# Altium schematic sheet p1_apfc_and_standby.SchDoc
size A2; Organization: Protel International P/L; Address1: L3, 12a Rodborough Rd; Address2: Frenchs Forest; Address3: NSW; Address4: Australia 2086
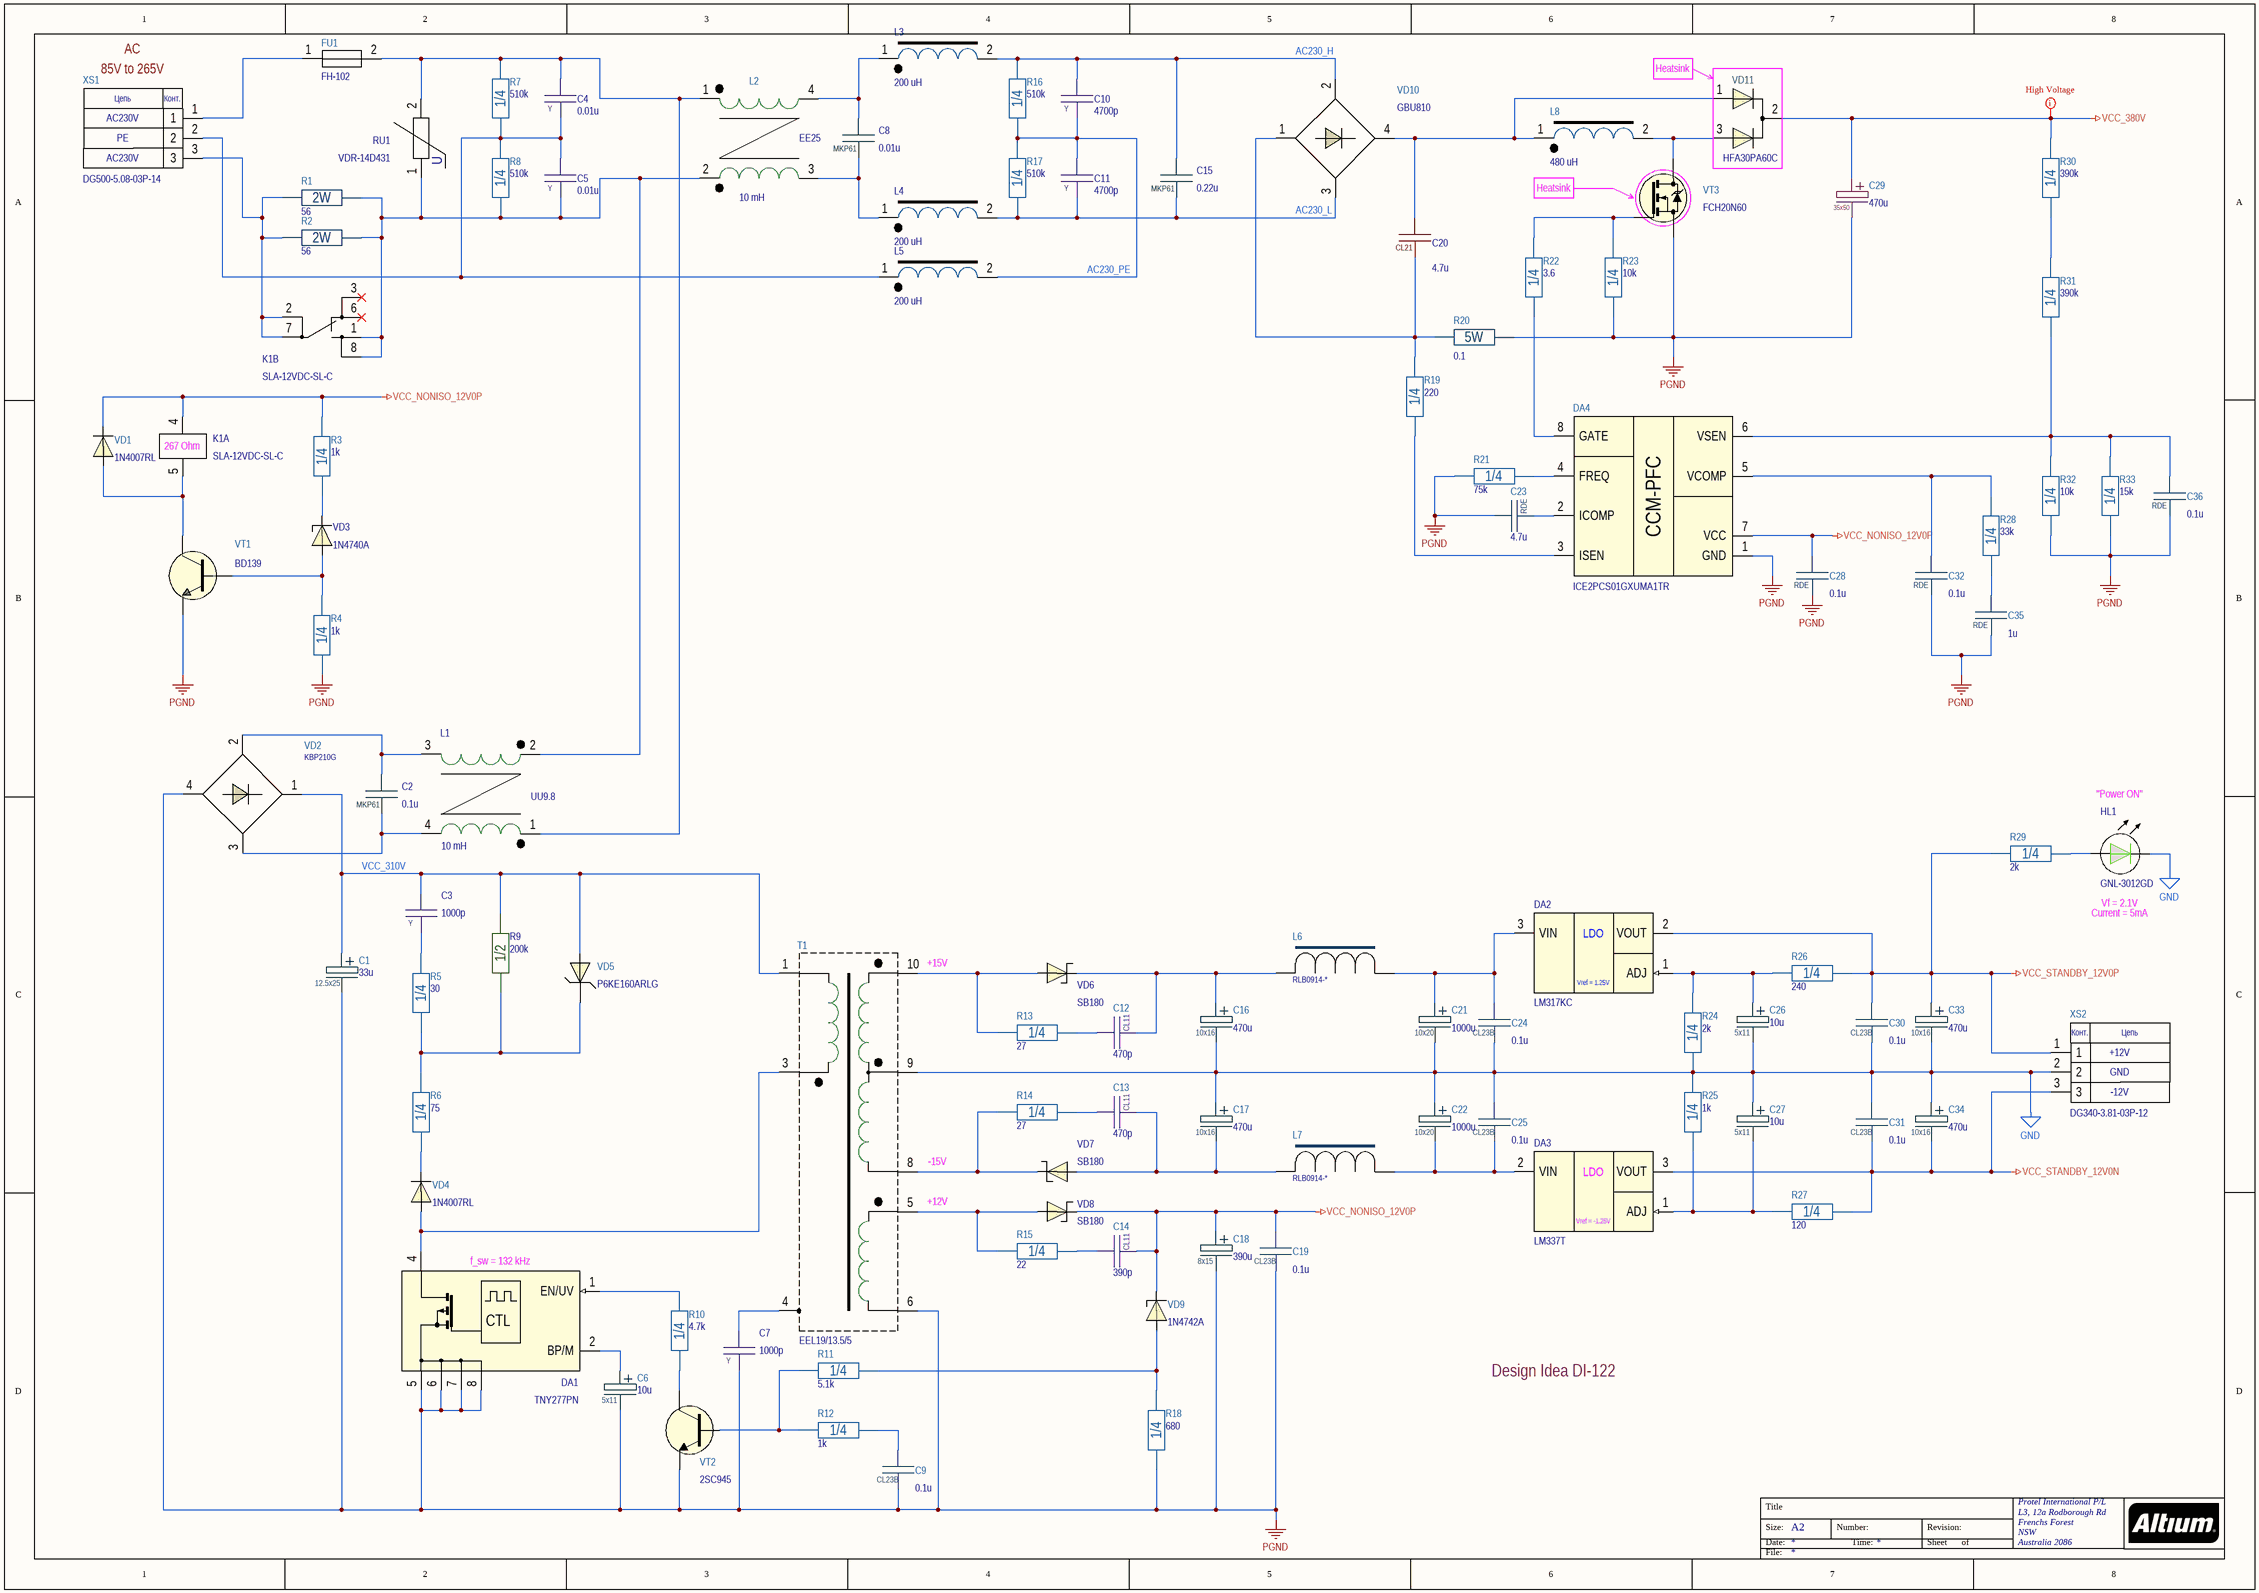
[diagram p0: p1_apfc_and_standby.SchDoc]

## Parts
C1  33u  Package: 12.5x25  [ECAP13X21X5_BRW]
C2  0.1u  [MKP61_13x12x6_P10]
C3  1000p  Package: Y  [JYC_Y2_CAP_7.5]
C4  0.01u  Package: Y  [JYC_Y2_CAP_6.5]
C5  0.01u  Package: Y  [JYC_Y2_CAP_6.5]
C6  10u  Package: 5x11  [ECAP5X11X2.0_BRW]
C7  1000p  Package: Y  [JYC_Y2_CAP_7.5]
C8  0.01u  [MKP61_18x12x6_P15]
C9  0.1u  [CL23B_7.2x2.5]
C10  4700p  Package: Y  [JYC_Y2_CAP_6.5]
C11  4700p  Package: Y  [JYC_Y2_CAP_6.5]
C12  470p  [CL11_6x4_P4.0]
C13  470p  [CL11_6x4_P4.0]
C14  390p  [CL11_6x4_P4.0]
C15  0.22u  [MKP61_18x14.5x8.5_P15]
C16  470u  Package: 10x16  [ECAP10X17X5_BRW]
C17  470u  Package: 10x16  [ECAP10X17X5_BRW]
C18  390u  Package: 8x15  [ECAP8X13.5X3.5_BRW]
C19  0.1u  [CL23B_7.2x2.5]
C20  4.7u  [CL21_29x24.5x14.0_P27.5]
C21  1000u  Package: 10x20  [ECAP10X21X5_BRW]
C22  1000u  Package: 10x20  [ECAP10X21X5_BRW]
C23  4.7u  Package: RDE  [RDE_2P1]
C24  0.1u  [CL23B_7.2x2.5]
C25  0.1u  [CL23B_7.2x2.5]
C26  10u  Package: 5x11  [ECAP5X11X2.0_BRW]
C27  10u  Package: 5x11  [ECAP5X11X2.0_BRW]
C28  0.1u  Package: RDE  [RDE_1P1]
C29  470u  Package: 35x50  [ECAP35X50X10]
C30  0.1u  [CL23B_7.2x2.5]
C31  0.1u  [CL23B_7.2x2.5]
C32  0.1u  Package: RDE  [RDE_1P1]
C33  470u  Package: 10x16  [ECAP10X17X5_BRW]
C34  470u  Package: 10x16  [ECAP10X17X5_BRW]
C35  1u  Package: RDE  [RDE_2P1]
C36  0.1u  Package: RDE  [RDE_1P1]
DA1  TNY277PN  [DIP-8C]
DA2  LM317KC  [TO-220A-3]
DA3  LM337T  [TO-220A-3]
DA4  ICE2PCS01GXUMA1TR  [SOIC-8_with_DIP-8]
FU1  FH-102  [FH-102]
HL1  GNL-3012GD  [GNL-3012GD]
K1  SLA-12VDC-SL-C  [RELAY_13x29.5MM]  (parts A,B of 2)
L1  10 mH  [UU9.8]
L2  10 mH  [EE25/10/6]
L3  200 uH  [CORE_D20_GB]
L4  200 uH  [CORE_D20_GB]
L5  200 uH  [CORE_D20_YW]
L6  RLB0914-*  [RLB0914]
L7  RLB0914-*  [RLB0914]
L8  480 uH  [CORE_D36_GB]
R1  56  Package: 2W  [CFR-200(VERTICAL)]
R2  56  Package: 2W  [CFR-200(VERTICAL)]
R3  1k  Package: 1/4  [CFR-25]
R4  1k  Package: 1/4  [CFR-25]
R5  30  Package: 1/4  [CFR-25]
R6  75  Package: 1/4  [CFR-25(VERTICAL)]
R7  510k  Package: 1/4  [CFR-25]
R8  510k  Package: 1/4  [CFR-25]
R9  200k  Package: 1/2  [CFR-50]
R10  4.7k  Package: 1/4  [CFR-25(VERTICAL)]
R11  5.1k  Package: 1/4  [CFR-25(VERTICAL)]
R12  1k  Package: 1/4  [CFR-25]
R13  27  Package: 1/4  [CFR-25(VERTICAL)]
R14  27  Package: 1/4  [CFR-25(VERTICAL)]
R15  22  Package: 1/4  [CFR-25(VERTICAL)]
R16  510k  Package: 1/4  [CFR-25]
R17  510k  Package: 1/4  [CFR-25]
R18  680  Package: 1/4  [CFR-25]
R19  220  Package: 1/4  [CFR-25(VERTICAL)]
R20  0.1  Package: 5W  [BPR58]
R21  75k  Package: 1/4  [CFR-25]
R22  3.6  Package: 1/4  [CFR-25(VERTICAL)]
R23  10k  Package: 1/4  [CFR-25]
R24  2k  Package: 1/4  [CFR-25(VERTICAL)]
R25  1k  Package: 1/4  [CFR-25(VERTICAL)]
R26  240  Package: 1/4  [CFR-25(VERTICAL)]
R27  120  Package: 1/4  [CFR-25(VERTICAL)]
R28  33k  Package: 1/4  [CFR-25(VERTICAL)]
R29  2k  Package: 1/4  [CFR-25(VERTICAL)]
R30  390k  Package: 1/4  [CFR-25(VERTICAL)]
R31  390k  Package: 1/4  [CFR-25(VERTICAL)]
R32  10k  Package: 1/4  [CFR-25(VERTICAL)]
R33  15k  Package: 1/4  [CFR-25(VERTICAL)]
RU1  VDR-14D431  [VARISTOR_14D]
T1  EEL19/13.5/5  [EEL19/13.5/5]
VD1  1N4007RL  [DO-41]
VD2  KBP210G  [KBP210G]
VD3  1N4740A  [DO-41 GLASS DARK RED]
VD4  1N4007RL  [DO-41]
VD5  P6KE160ARLG  [DO-15]
VD6  SB180  [DO-41]
VD7  SB180  [DO-41]
VD8  SB180  [DO-41]
VD9  1N4742A  [DO-41 GLASS DARK RED]
VD10  GBU810  [GBU810]
VD11  HFA30PA60C  [TO-247_with_dual_TO-220]
VT1  BD139  [TO-126 (VERTICAL)]
VT2  2SC945  [TO-92 (VERTICAL,LINE)]
VT3  FCH20N60  [TO-247_with_TO-220 (VERTICAL)]
XS1  DG500-5.08-03P-14  [DG500-5.08-03P]
XS2  DG340-3.81-03P-12  [DG340-3.81-03P]

## Nets
GND: C16.2 C17.1 C21.2 C22.1 C24.2 C25.1 C26.2 C27.1 C30.2 C31.1 C33.2 C34.1 HL1.1 R24.1 R25.2 T1.9 XS2.2
PGND: C1.2 C6.2 C7.1 C9.2 C18.2 C19.2 C23.1 C28.2 C29.2 C32.2 C35.2 C36.2 DA1.5(SOURCE) DA1.6(SOURCE) DA1.7(SOURCE) DA1.8(SOURCE) DA4.1(GND) R4.1 R18.2 R20.2 R21.2 R23.1 R32.2 R33.1 T1.6 VD2.4(P) VT1.3(E) VT2.3(E) VT3.3(S)
VCC_380V: C29.1 R30.2 VD11.2(C)
VCC_NONISO_12V0P: C14.1 C18.1 C19.1 C28.1 DA4.7(VCC) K1.4 R3.2 VD1.1(C) VD8.1(C) VD9.1(CATHODE)
VCC_STANDBY_12V0N: C31.2 C34.2 DA3.3(VOUT) R27.1 XS2.3
VCC_STANDBY_12V0P: C30.1 C33.1 DA2.2(VOUT) R26.1 R29.2 XS2.1
AC230_H: C10.1 C15.2 L3.2 R16.2 VD10.2(AC1)
AC230_L: C11.2 C15.1 L4.2 R17.1 VD10.3(AC2)
AC230_PE: C10.2 C11.1 L5.2 R16.1 R17.2
VCC_310V: C1.1 C3.2 R9.2 T1.1 VD2.1(M) VD5.2(A)
NetC2_1: C2.1 L1.4 VD2.3(AC2)
NetC2_2: C2.2 L1.3 VD2.2(AC1)
NetC3_1: C3.1 R5.1
NetC4_1: C4.1 FU1.2 L1.1 L2.1 R7.2 RU1.2
NetC4_2: C4.2 C5.1 L5.1 R7.1 R8.2 XS1.2
NetC5_2: C5.2 K1.1 K1.8 L1.2 L2.2 R1.1 R2.1 R8.1 RU1.1
NetC6_1: C6.1 DA1.2(BP/M)
NetC7_2: C7.2 T1.4
NetC8_1: C8.1 L2.3 L4.1
NetC8_2: C8.2 L2.4 L3.1
NetC9_1: C9.1 R12.2
NetC12_1: C12.1 C16.1 L6.1 VD6.1(C)
NetC12_2: C12.2 R13.1
NetC13_1: C13.1 C17.2 L7.1 VD7.2(A)
NetC13_2: C13.2 R14.1
NetC14_2: C14.2 R15.1
NetC20_1: C20.1 R19.2 R20.1 VD10.1(M)
NetC20_2: C20.2 L8.1 VD10.4(P) VD11.1(A1)
NetC21_1: C21.1 C24.1 DA2.3(VIN) L6.2
NetC22_2: C22.2 C25.2 DA3.2(VIN) L7.2
NetC23_2: C23.2 DA4.2(ICOMP)
NetC26_1: C26.1 DA2.1(ADJ) R24.2 R26.2
NetC27_2: C27.2 DA3.1(ADJ) R25.1 R27.2
NetC32_1: C32.1 DA4.5(VCOMP) R28.2
NetC35_1: C35.1 R28.1
NetC36_1: C36.1 DA4.6(VSEN) R31.1 R32.1 R33.2
NetDA1_1: DA1.1(EN/UV) R10.1
NetDA1_4: DA1.4(DRAIN) T1.3 VD4.2(A)
NetDA4_3: DA4.3(ISEN) R19.1
NetDA4_4: DA4.4(FREQ) R21.1
NetDA4_8: DA4.8(GATE) R22.1
NetFU1_1: FU1.1 XS1.1
NetHL1_2: HL1.2 R29.1
NetK1_2: K1.2 K1.7 R1.2 R2.2 XS1.3
NetK1_5: K1.5 VD1.2(A) VT1.2(C)
NetL8_2: L8.2 VD11.3(A2) VT3.2(D)
NetR3_1: R3.1 VD3.1(CATHODE)
NetR4_2: R4.2 VD3.2(ANODE) VT1.1(B)
NetR5_2: R5.2 R6.1 R9.1 VD5.1(C)
NetR6_2: R6.2 VD4.1(C)
NetR10_2: R10.2 VT2.2(C)
NetR11_1: R11.1 R18.1 VD9.2(ANODE)
NetR11_2: R11.2 R12.1 VT2.1(B)
NetR13_2: R13.2 T1.10 VD6.2(A)
NetR14_2: R14.2 T1.8 VD7.1(C)
NetR15_2: R15.2 T1.5 VD8.2(A)
NetR22_2: R22.2 R23.2 VT3.1(G)
NetR30_1: R30.1 R31.2

Not connected (* = marked no-connect by the designer): K1 3* 6*

## Layout directives
net class POWER_HIGH_VOLTAGE: VCC_380V

## Notes on the sheet
- AC
- 85V to 265V
- Heatsink
- AC230V
- PE
- (near K1) 267 Ohm
- "Power ON"
- Vf = 2.1V
- Current = 5mA
- (near T1) +15V
- (near XS2) +12V
- (near XS2) -12V
- GND
- (near T1) -15V
- (near T1) +12V
- (near DA1) f_sw = 132 kHz
- Design Idea DI-122 <https://www.power.com/sites/default/files/documents/di122.pdf>
- Title
- Size:
- Date:
- File:
- A2
- Number:
- Time:
- Revision:
- Sheet
- of
- (in symbol DG340-3.81-03P-12) Конт.; Цепь
- (in symbol DG500-5.08-03P-14) Цепь; Конт.
- (in symbol ICE2PCS01GXUMA1TR) CCM-PFC
- (in symbol LM317KC) LDO; Vref = 1.25V
- (in symbol LM337T) LDO; Vref = -1.25V
- (in symbol TNY277PN) CTL
- (in symbol VARISTOR) U

## Library data of the parts
C1 = C_ECAP: Aluminium capacitor; Part Number: UCY2G330MHD; Manufacturer: Nichicon; Tolerance: ± 20 %; Voltage: 400V; Value: 33u; Value on schem: 33u
C2 C8 C15 = MKP61: Metallized Polypropylene Film Capacitor for high voltage application; Tolerance: ± 10 %; Voltage: 300V; Dielectric: Polypropylene; Part Number: *; Manufacturer: *; Package: MKP61
  C2: Value: 0.1u; Value on schem: 0.1u
  C8: Value: 0.01u; Value on schem: 0.01u
  C15: Value: 0.22u; Value on schem: 0.22u
C3 C7 = JB_Y2: High Voltage Ceramic Capacitor; Part Number: JYC3D102MBE; Manufacturer: JB; Tolerance: ± 20 %; Dielectric: Y5U; Voltage: 2000V; Value: 1000p; Value on schem: 1000p
C4 C5 = JB_Y2: High Voltage Ceramic Capacitor; Part Number: JYC3D103MCF; Manufacturer: JB; Tolerance: ± 20 %; Dielectric: Y5V; Voltage: 2000V; Value: 0.01u; Value on schem: 0.01u
C6 C26 C27 = C_ECAP: Aluminium capacitor; Part Number: UVR1J100MDD1TA; Manufacturer: Nichicon; Tolerance: ± 20 %; Voltage: 63V; Value: 10u; Value on schem: 10u
C9 C19 C24 C25 C30 C31 = CL23B: Box-type metallized polyester film capacitor; Tolerance: ± * %; Voltage: 63V; Value: 0.1u; Dielectric: Polyester; Value on schem: 0.1u; Part Number: *; Manufacturer: *; Package: CL23B
C10 C11 = JB_Y2: High Voltage Ceramic Capacitor; Part Number: JYC3D472MBF; Manufacturer: JB; Tolerance: ± 20 %; Dielectric: Y5V; Voltage: 2000V; Value: 4700p; Value on schem: 4700p
C12 C13 = CL11: CL11 Type Polyester Film Metal Foil Capacitor-inductive; Part Number: CL11-2A471J; Manufacturer: Shengxin Capacitors; Tolerance: ± 5 %; Voltage: 100V; Value: 470p; Dielectric: Polyester; Value on schem: 470p; Package: CL11
C14 = CL11: CL11 Type Polyester Film Metal Foil Capacitor-inductive; Part Number: CL11-2A391J; Manufacturer: Shengxin Capacitors; Tolerance: ± 5 %; Voltage: 100V; Value: 390p; Dielectric: Polyester; Value on schem: 390p; Package: CL11
C16 C17 C33 C34 = C_ECAP: Aluminium capacitor; Part Number: UPW1E471MPD; Manufacturer: Nichicon; Tolerance: ± 20 %; Voltage: 25V; Value: 470u; Value on schem: 470u
C18 = C_ECAP: Aluminium capacitor; Part Number: EEUFR1E391L; Manufacturer: Panasonic; Tolerance: ± 20 %; Voltage: 25V; Value: 390u; Value on schem: 390u
C20 = CL21: CL21 Type Metallized Polyester Film Capacitor; Tolerance: ± * %; Voltage: 630V; Value: 4.7u; Dielectric: Polyester; Value on schem: 4.7u; Part Number: *; Manufacturer: *; Package: CL21
C21 C22 = C_ECAP: Aluminium capacitor; Part Number: UVZ1E102MPD; Manufacturer: Nichicon; Tolerance: ± 20 %; Voltage: 25V; Value: 1000u; Value on schem: 1000u
C23 = RDE_CAP: MLCC radial lead type with epoxy coat (RDE Series); Part Number: RDEC71H475K2P1H03B; Manufacturer: Murata; Tolerance: ± 10 %; Dielectric: X7S; Voltage: 50V; Value: 4.7u; Value on schem: 4.7u
C28 C32 C36 = RDE_CAP: MLCC radial lead type with epoxy coat (RDE Series); Part Number: RDER72A104K1P1H03B; Manufacturer: Murata; Tolerance: ± 10 %; Dielectric: X7R; Voltage: 100V; Value: 0.1u; Value on schem: 0.1u
C29 = ECAP_35x50: Aluminium capacitors 35x50mm; Part Number: LG450M0470BPF-3550; Manufacturer: Yageo; Tolerance: ± 20 %; Voltage: 450V; Value: 470u; Value on schem: 470u
C35 = RDE_CAP: MLCC radial lead type with epoxy coat (RDE Series); Part Number: RDER71H105K2P1H03B; Manufacturer: Murata; Tolerance: ± 10 %; Dielectric: X7R; Voltage: 50V; Value: 1u; Value on schem: 1u
DA1 = TNY277PN: Energy-Effi cient, Off-Line Switcher With Enhanced Flexibility and Extended Power Range; Manufacturer: Power Integrations; Package: DIP-8C; Part Number: TNY277PN
DA2 = LM317KC: 1.5 A 3-Terminal Adjustable Regulator; Manufacturer: Texas Instruments; Package: TO-220; Part Number: LM317KC
DA3 = LM337T: -1.5A  3-Terminal Adjustable Negative Regulators; Manufacturer: Texas Instruments; Package: TO-220; Part Number: LM337T
DA4 = ICE2PCS01GXUMA1TR: PFC Controller in Continuous Conduction Mode; Manufacturer: Infineon; Part Number: ICE2PCS01GXUMA1TR; Package: SOIC-8
FU1 = FH-102: Fuse holder 5.2х20mm; Package: Dragon City; Part Number: FH-102
HL1 = GNL-3012GD: Standard Brightness 3mm LED; Manufacturer: G-Nor Optoelectronics; Color: Green, 565 nm; Package: 3mm; Part Number: GNL-3012GD
K1 = SMIH-12VDC-SL-C: Subminature high power relay 16A; Manufacturer: Songle Relay; Coil Power Dissipation: 0.9W; Coil Current: 12V@75mA; Coil Resistance: 160 Ohm; Package: 32mm x27.5mm; Part Number: SLA-12VDC-SL-C
L1 = UU9.8: UU9.8 Ferrite Core inductor; Value: 10 mH; Core: UU9.8
L2 = EE25: EE25 Ferrite Core inductor; Value: 10 mH; Core: EE25
L3-L5 = CORE_D20: Ferrite Core D20.3/12.7/6.35 mm; Core: D20; Value: 200 uH
L6 L7 = RLB0914: Radial Inductors; Manufacturer: Bourns Inc.; RDC: * Ohm; SRF Min: * MHz; Irms  Max: * A; Inductance @ 100 kHz: * µH; Part Number: RLB0914-*; Package: 8.7x12mm; Q: *; Isat  Typ: * A
L8 = CORE_D36: Ferrite Core D35.8/22.4/10.5 mm; Core: D36; Value: 480 uH
R1 R2 = CF200: Resistor 2W; Part Number: KNP200JB-73-56R; Manufacturer: Yageo; Tolerance: ± 5 %; Voltage: 250V; Temperature Coefficient: ±300 ppm/°C; Value: 56; Value on schem: 56
R3 R4 R12 R25 = CF25: Resistor 1/4W; Part Number: MFR-25FTF52-1K; Manufacturer: Yageo; Tolerance: ± 1 %; Voltage: 250V; Temperature Coefficient: ±100 ppm/°C; Value: 1k; Value on schem: 1k
R5 = CF25: Resistor 1/4W; Part Number: MFR-25FTF52-30R; Manufacturer: Yageo; Tolerance: ± 1 %; Voltage: 250V; Temperature Coefficient: ±100 ppm/°C; Value: 30; Value on schem: 30
R6 = CF25: Resistor 1/4W; Part Number: MFR-25FTF52-75R; Manufacturer: Yageo; Tolerance: ± 1 %; Voltage: 250V; Temperature Coefficient: ±100 ppm/°C; Value: 75; Value on schem: 75
R7 R8 R16 R17 = CF25: Resistor 1/4W; Part Number: MFR-25FTF52-510K; Manufacturer: Yageo; Tolerance: ± 1 %; Voltage: 250V; Temperature Coefficient: ±100 ppm/°C; Value: 510k; Value on schem: 510k
R9 = CF50: Resistor 1/2W; Part Number: MFR-50JT-52-200K; Manufacturer: Yageo; Tolerance: ± 5 %; Temperature Coefficient: 350V; Value: 200k; Value on schem: 200k; Voltage: *
R10 = CF25: Resistor 1/4W; Part Number: MFR-25FTF52-4K7; Manufacturer: Yageo; Tolerance: ± 1 %; Voltage: 250V; Temperature Coefficient: ±100 ppm/°C; Value: 4.7k; Value on schem: 4.7k
R11 = CF25: Resistor 1/4W; Part Number: MFR-25FTF52-5K1; Manufacturer: Yageo; Tolerance: ± 1 %; Voltage: 250V; Temperature Coefficient: ±100 ppm/°C; Value: 5.1k; Value on schem: 5.1k
R13 R14 = CF25: Resistor 1/4W; Part Number: MFR-25FTF52-27R; Manufacturer: Yageo; Tolerance: ± 1 %; Voltage: 250V; Temperature Coefficient: ±100 ppm/°C; Value: 27; Value on schem: 27
R15 = CF25: Resistor 1/4W; Part Number: MFR-25FTF52-22R; Manufacturer: Yageo; Tolerance: ± 1 %; Voltage: 250V; Temperature Coefficient: ±100 ppm/°C; Value: 22; Value on schem: 22
R18 = CF25: Resistor 1/4W; Part Number: MFR-25FTF52-680R; Manufacturer: Yageo; Tolerance: ± 1 %; Voltage: 250V; Temperature Coefficient: ±100 ppm/°C; Value: 680; Value on schem: 680
R19 = CF25: Resistor 1/4W; Part Number: MFR-25FTF52-220R; Manufacturer: Yageo; Tolerance: ± 1 %; Voltage: 250V; Temperature Coefficient: ±100 ppm/°C; Value: 220; Value on schem: 220
R20 = BPR58: Rectangular type metal plate resistors; Part Number: BPR58CR10J; Manufacturer: KOA Speer; Tolerance: ± 5 %; Temperature Coefficient: ±350 /°C; Value: 0.1; Value on schem: 0.1
R21 = CF25: Resistor 1/4W; Part Number: MFR-25FTF52-75K; Manufacturer: Yageo; Tolerance: ± 1 %; Voltage: 250V; Temperature Coefficient: ±100 ppm/°C; Value: 75k; Value on schem: 75k
R22 = CF25: Resistor 1/4W; Part Number: MFR-25FTF52-3R6; Manufacturer: Yageo; Tolerance: ± 1 %; Voltage: 250V; Temperature Coefficient: ±100 ppm/°C; Value: 3.6; Value on schem: 3.6
R23 R32 = CF25: Resistor 1/4W; Part Number: MFR-25FTF52-10K; Manufacturer: Yageo; Tolerance: ± 1 %; Voltage: 250V; Temperature Coefficient: ±100 ppm/°C; Value: 10k; Value on schem: 10k
R24 R29 = CF25: Resistor 1/4W; Part Number: MFR-25FTF52-2K; Manufacturer: Yageo; Tolerance: ± 1 %; Voltage: 250V; Temperature Coefficient: ±100 ppm/°C; Value: 2k; Value on schem: 2k
R26 = CF25: Resistor 1/4W; Part Number: MFR-25FTF52-240R; Manufacturer: Yageo; Tolerance: ± 1 %; Voltage: 250V; Temperature Coefficient: ±100 ppm/°C; Value: 240; Value on schem: 240
R27 = CF25: Resistor 1/4W; Part Number: MFR-25FTF52-120R; Manufacturer: Yageo; Tolerance: ± 1 %; Voltage: 250V; Temperature Coefficient: ±100 ppm/°C; Value: 120; Value on schem: 120
R28 = CF25: Resistor 1/4W; Part Number: MFR-25FTF52-33K; Manufacturer: Yageo; Tolerance: ± 1 %; Voltage: 250V; Temperature Coefficient: ±100 ppm/°C; Value: 33k; Value on schem: 33k
R30 R31 = CF25: Resistor 1/4W; Part Number: MFR-25FTF52-390K; Manufacturer: Yageo; Tolerance: ± 1 %; Voltage: 250V; Temperature Coefficient: ±100 ppm/°C; Value: 390k; Value on schem: 390k
R33 = CF25: Resistor 1/4W; Part Number: MFR-25FTF52-15K; Manufacturer: Yageo; Tolerance: ± 1 %; Voltage: 250V; Temperature Coefficient: ±100 ppm/°C; Value: 15k; Value on schem: 15k
RU1 = VARISTOR: Package: *; Part Number: VDR-14D431
T1 = EEL19_V1: EEL19 Ferrite Core, 2 output; Value: EEL19/13.5/5
VD1 VD4 = 1N4007RL: 1A 1000V Standard Recovery Rectifiers Diode; Manufacturer: ON Semiconductor; Part Number: 1N4007RL; Package: DO-41
VD2 = KBP210G: 2A single phase bridge rectifier; Manufacturer: Diodes Incorporated; Package: KBP; Part Number: KBP210G
VD3 = 1N4740A: 10V 1.0W ZENER DIODE; Manufacturer: Diodes Incorporated; Part Number: 1N4740A; Package: DO-41
VD5 = P6KE160ARLG: 600 Watt Peak Power Transient / Voltage Suppressors; Manufacturer: ON Semiconductor; Part Number: P6KE160ARLG; Package: DO-15
VD6-VD8 = SB180: 1A, 80V Schottky Barrier Rectifier; Manufacturer: ON Semiconductor; Part Number: SB180; Package: DO-41
VD9 = 1N4742A: 12V 1.0W ZENER DIODE; Manufacturer: Diodes Incorporated; Part Number: 1N4742A; Package: DO-41
VD10 = GBU810: 8A single phase bridge rectifier; Manufacturer: Diodes Incorporated; Package: GBU; Part Number: GBU810
VD11 = HFA30PA60C: Ultrafast, Soft Recovery Diode 600V, 15A; Manufacturer: Infineon; Package: TO-247AC; Part Number: HFA30PA60C
VT1 = BD139: General Purpose n-p-n Transistors; Manufacturer: STMicroelectronics; Package: TO-126; Part Number: BD139
VT2 = 2SC945: General Purpose n-p-n Transistors; Manufacturer: NEC; Package: TO-92; Part Number: 2SC945
VT3 = FCH20N60: 600V @ 20A N-Channel MOSFET; Manufacturer: ON Semiconductor; Part Number: FCH20N60; Package: TO-247
XS1 = DG500-5.08-03P-14: 3-way screw terminal, pitch 200mils (5.08mm); Manufacturer: DEGSON; Part Number: DG500-5.08-03P-14
XS2 = DG340-3.81-03P-12: 3-way screw terminal, pitch 150mils (3.81mm); Manufacturer: DEGSON; Part Number: DG340-3.81-03P-12